# Altium schematic sheet Top.SchDoc
size D; Organization: Altium Limited; Address1: L3, 12a Rodborough Rd; Address2: Frenchs Forest; Address3: NSW; Address4: Australia 2086
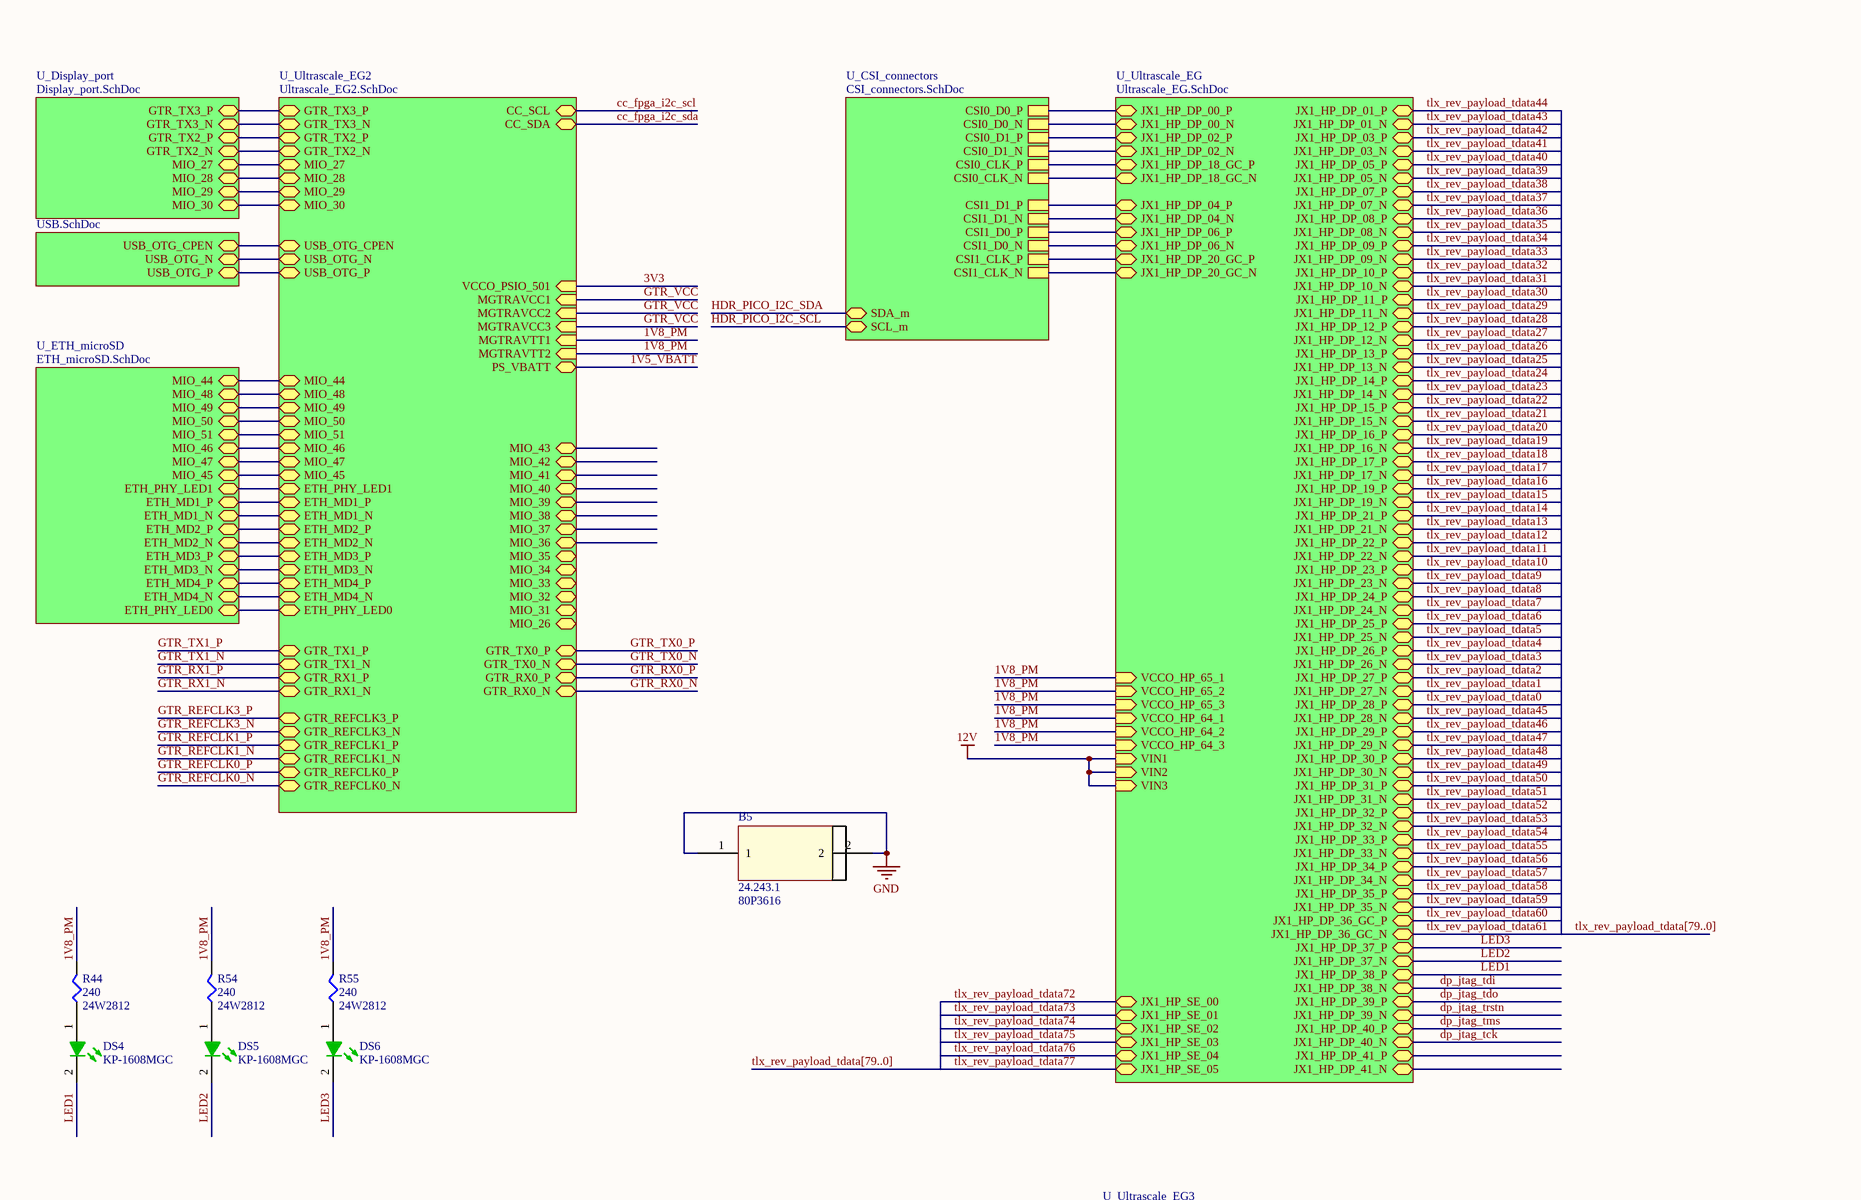
[diagram p0: Top.SchDoc, top left]
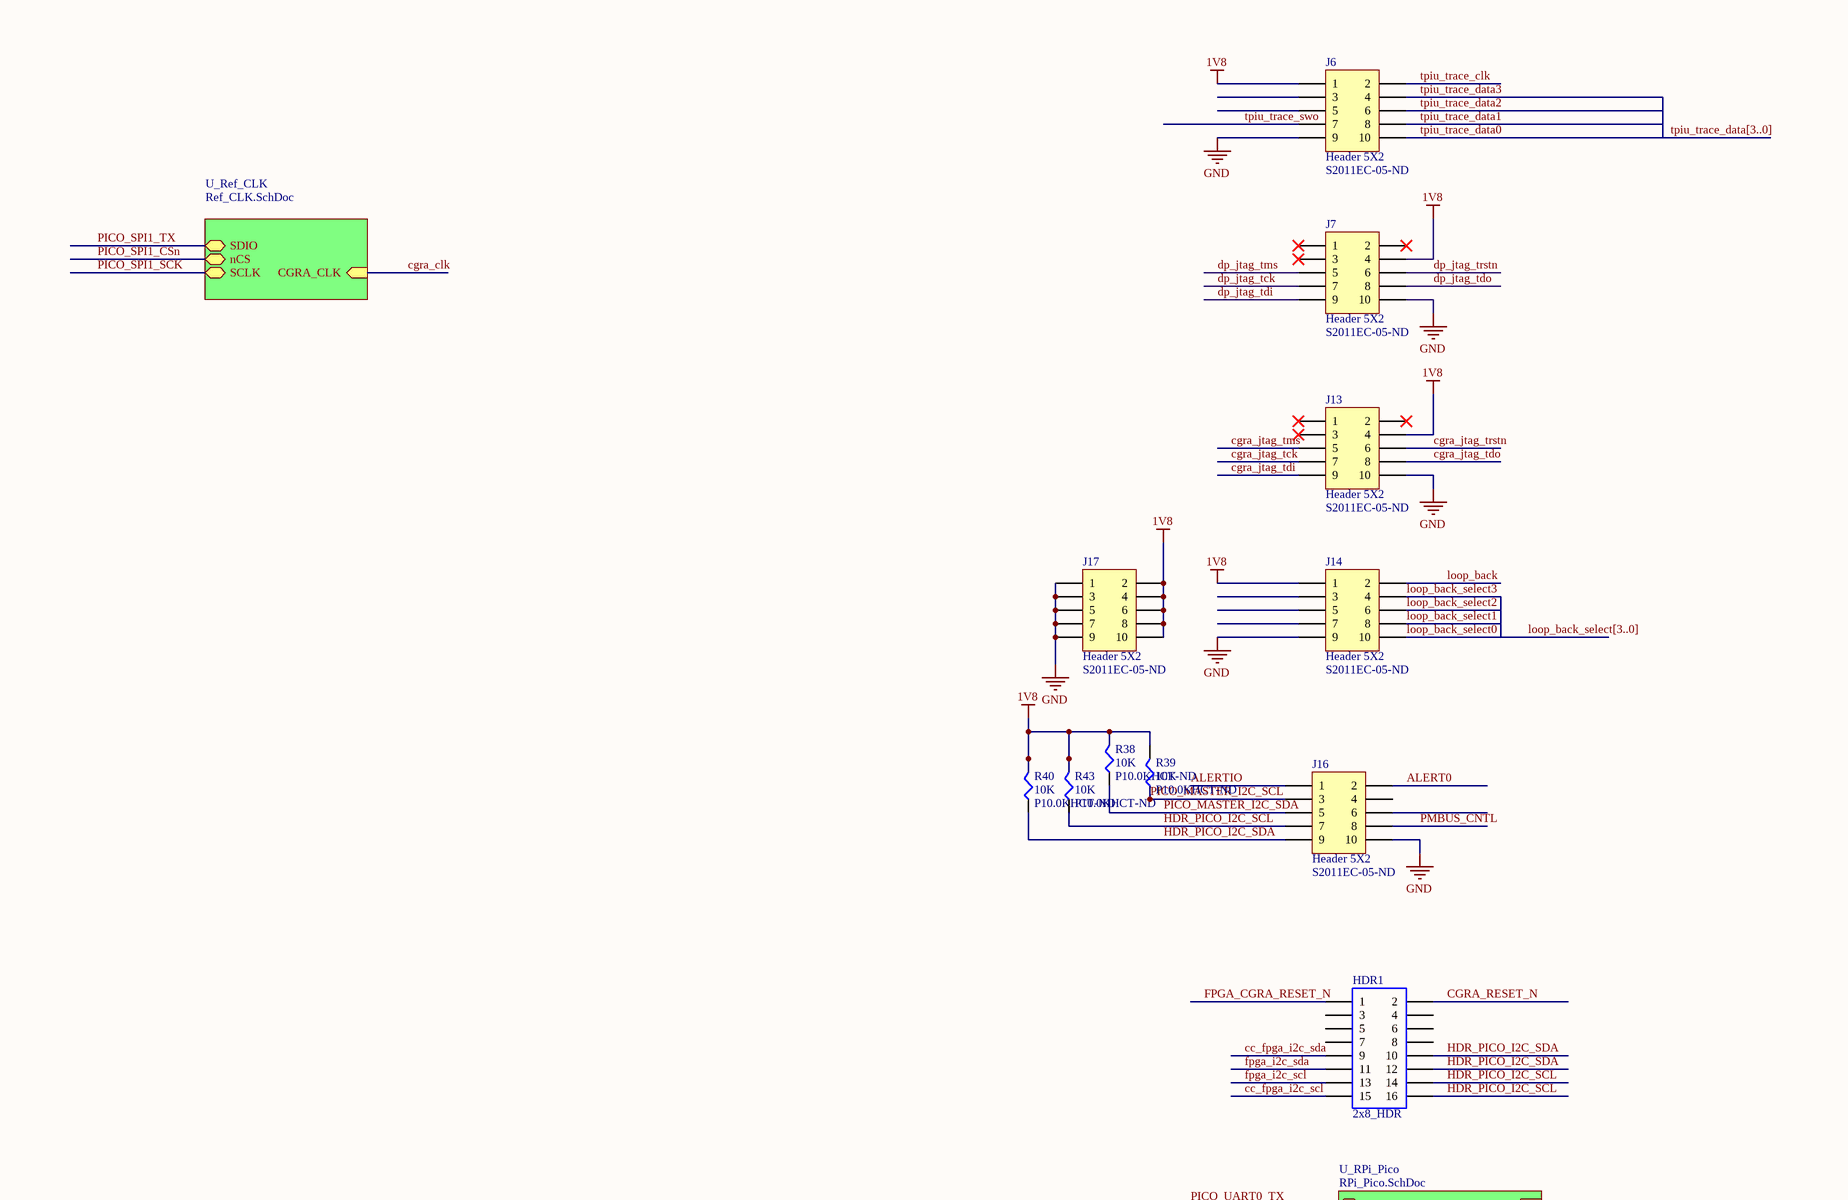
[diagram p1: Top.SchDoc, top right]
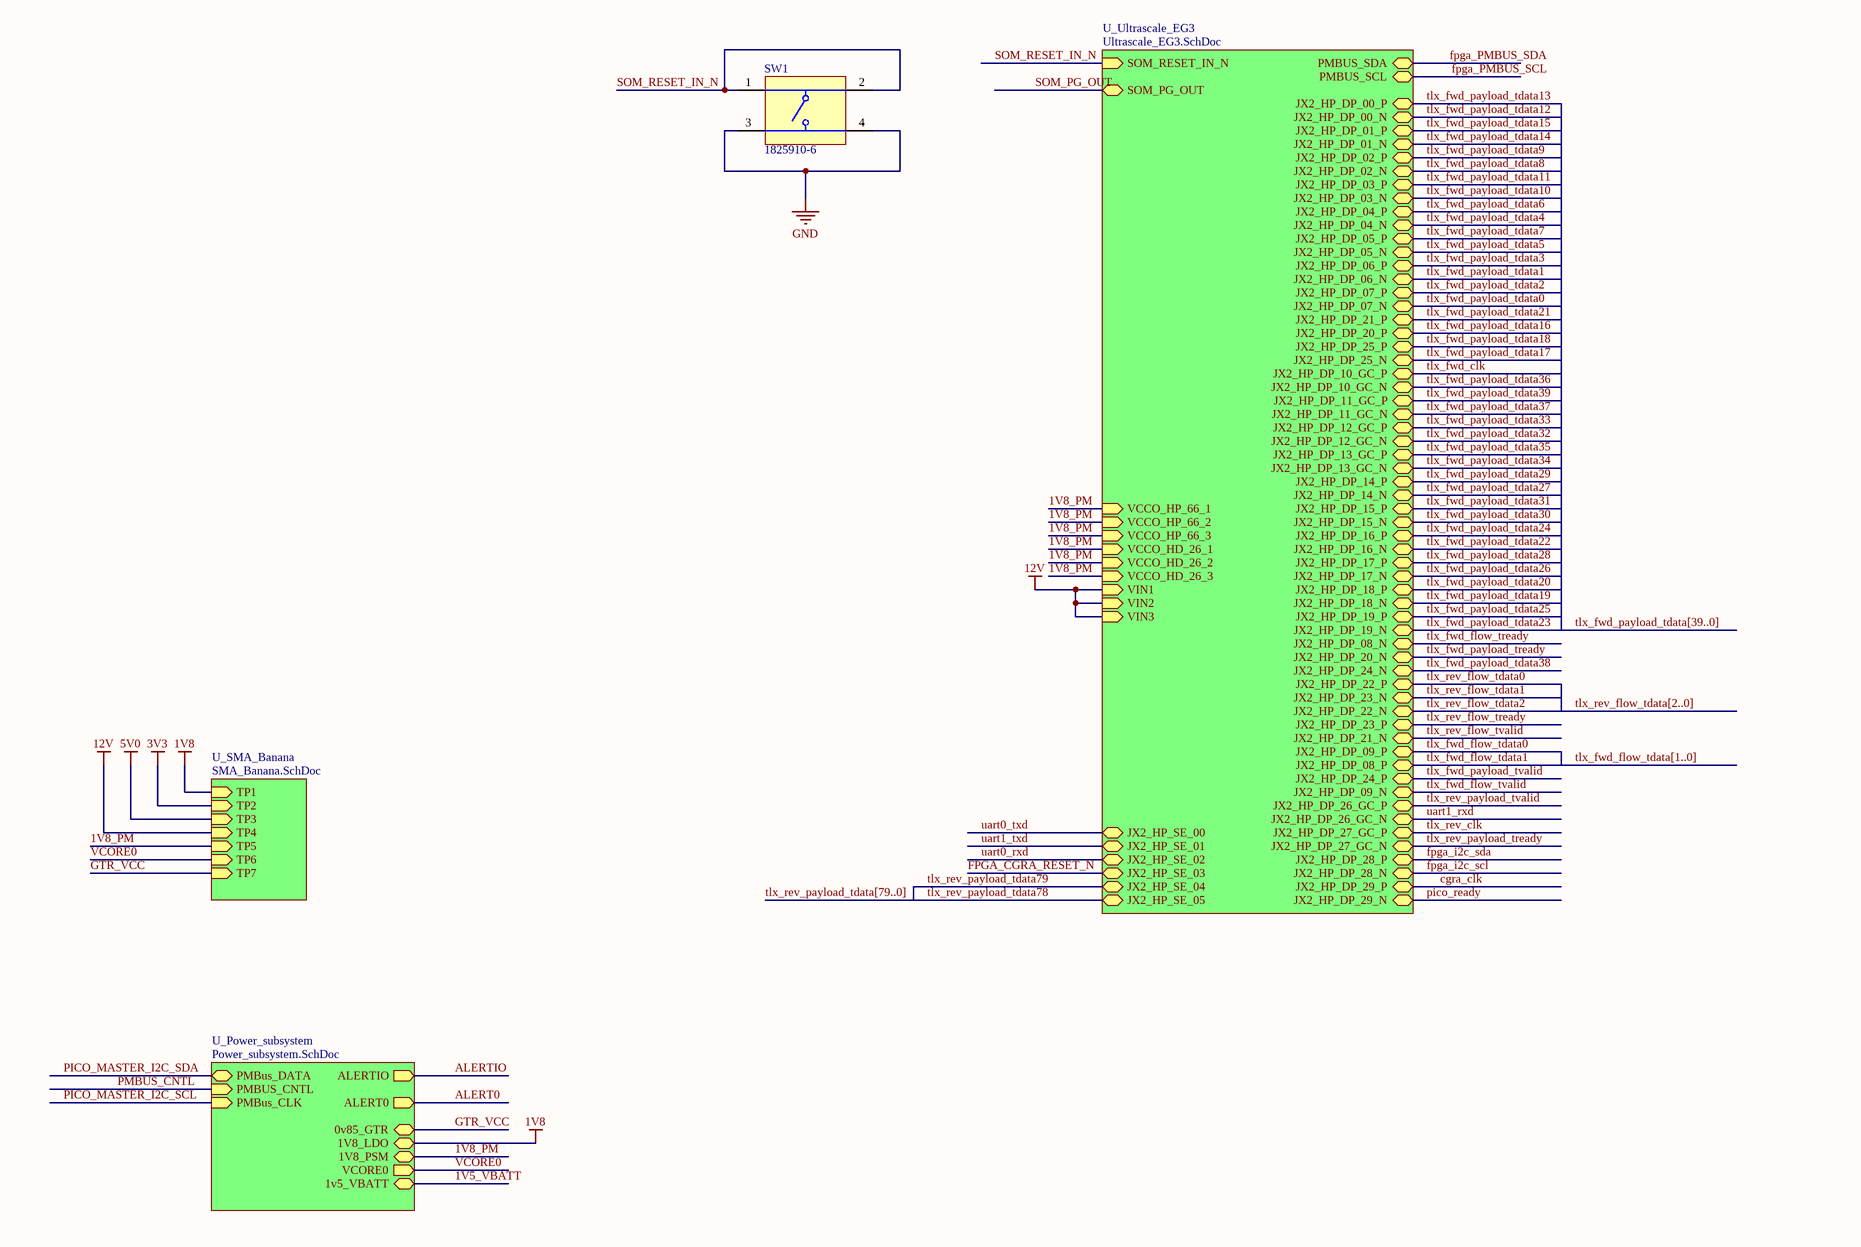
[diagram p2: Top.SchDoc, bottom left]
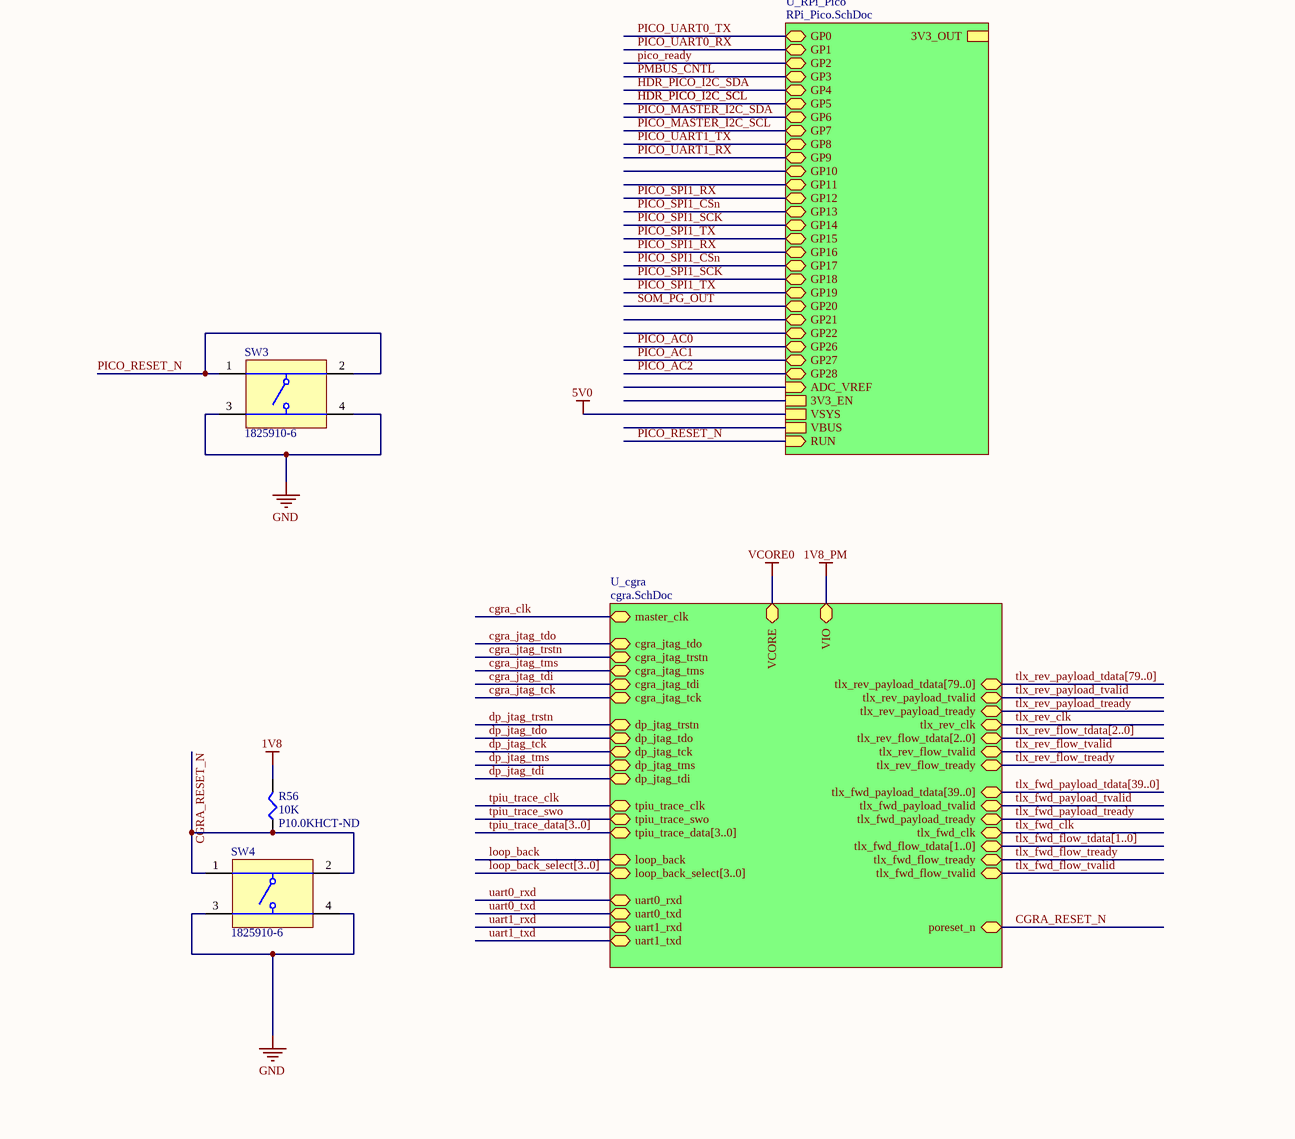
[diagram p3: Top.SchDoc, bottom right]

## Parts
B5  24.243.1  Supplier Part Number 1: 80P3616  [banana_clip]
DS4  KP-1608MGC  [KING-0603LED_GREEN_V]
DS5  KP-1608MGC  [KING-0603LED_GREEN_V]
DS6  KP-1608MGC  [KING-0603LED_GREEN_V]
HDR1  2x8_HDR  [16POSHDR]
J6  Header 5X2  Supplier Part Number 1: S2011EC-05-ND  [HDR2X5]
J7  Header 5X2  Supplier Part Number 1: S2011EC-05-ND  [HDR2X5]
J13  Header 5X2  Supplier Part Number 1: S2011EC-05-ND  [HDR2X5]
J14  Header 5X2  Supplier Part Number 1: S2011EC-05-ND  [HDR2X5]
J16  Header 5X2  Supplier Part Number 1: S2011EC-05-ND  [HDR2X5]
J17  Header 5X2  Supplier Part Number 1: S2011EC-05-ND  [HDR2X5]
R38  Resistance: 10K  Supplier Part Number 1: P10.0KHCT-ND  [RESC1608X06N]  (hidden comment: RES_10K_0603)
R39  Resistance: 10K  Supplier Part Number 1: P10.0KHCT-ND  [RESC1608X06N]  (hidden comment: RES_10K_0603)
R40  Resistance: 10K  Supplier Part Number 1: P10.0KHCT-ND  [RESC1608X06N]  (hidden comment: RES_10K_0603)
R43  Resistance: 10K  Supplier Part Number 1: P10.0KHCT-ND  [RESC1608X06N]  (hidden comment: RES_10K_0603)
R44  Resistance: 240  Supplier Part Number 1: 24W2812  [RESC1608X06N]  (hidden comment: RES_240_0603)
R54  Resistance: 240  Supplier Part Number 1: 24W2812  [RESC1608X06N]  (hidden comment: RES_240_0603)
R55  Resistance: 240  Supplier Part Number 1: 24W2812  [RESC1608X06N]  (hidden comment: RES_240_0603)
R56  Resistance: 10K  Supplier Part Number 1: P10.0KHCT-ND  [RESC1608X06N]  (hidden comment: RES_10K_0603)
SW1  1825910-6  [TECO-1825910-6_V]
SW3  1825910-6  [TECO-1825910-6_V]
SW4  1825910-6  [TECO-1825910-6_V]

## Sub-sheets
U_cgra = cgra.SchDoc: master_clk (bidir), cgra_jtag_tdo (bidir), cgra_jtag_trstn (bidir), cgra_jtag_tms (bidir), cgra_jtag_tdi (bidir), cgra_jtag_tck (bidir), dp_jtag_trstn (bidir), dp_jtag_tdo (bidir), dp_jtag_tck (bidir), dp_jtag_tms (bidir), dp_jtag_tdi (bidir), tlx_fwd_flow_tvalid (bidir), tlx_fwd_flow_tready (bidir), tlx_rev_flow_tready (bidir), tlx_rev_flow_tvalid (bidir), tlx_rev_clk (bidir), tlx_fwd_clk (bidir), tlx_rev_payload_tready (bidir), tlx_rev_payload_tvalid (bidir), tpiu_trace_clk (bidir), tpiu_trace_swo (bidir), tpiu_trace_data[3..0] (bidir), loop_back_select[3..0] (bidir), tlx_rev_flow_tdata[2..0] (bidir), tlx_fwd_flow_tdata[1..0] (bidir), tlx_fwd_payload_tdata[39..0] (bidir), tlx_rev_payload_tdata[79..0] (bidir), VCORE (bidir), VIO (bidir), loop_back (bidir), poreset_n (bidir), tlx_fwd_payload_tready (bidir), tlx_fwd_payload_tvalid (bidir), uart0_txd (bidir), uart1_txd (bidir), uart1_rxd (bidir), uart0_rxd (bidir)
U_CSI_connectors = CSI_connectors.SchDoc: CSI0_CLK_P, CSI0_CLK_N, CSI0_D0_P, CSI0_D0_N, CSI0_D1_P, CSI0_D1_N, CSI1_CLK_P, CSI1_CLK_N, CSI1_D1_P, CSI1_D1_N, CSI1_D0_P, CSI1_D0_N, SDA_m (bidir), SCL_m (bidir)
U_Display_port = Display_port.SchDoc: GTR_TX3_P (bidir), GTR_TX3_N (bidir), GTR_TX2_P (bidir), GTR_TX2_N (bidir), MIO_28 (bidir), MIO_29 (bidir), MIO_27 (bidir), MIO_30 (bidir)
U_ETH_microSD = ETH_microSD.SchDoc: MIO_44 (bidir), MIO_48 (bidir), MIO_49 (bidir), MIO_50 (bidir), MIO_51 (bidir), MIO_46 (bidir), MIO_47 (bidir), MIO_45 (bidir), ETH_PHY_LED1 (bidir), ETH_MD1_P (bidir), ETH_MD1_N (bidir), ETH_MD2_P (bidir), ETH_MD2_N (bidir), ETH_MD3_P (bidir), ETH_MD3_N (bidir), ETH_MD4_P (bidir), ETH_MD4_N (bidir), ETH_PHY_LED0 (bidir)
U_Power_subsystem = Power_subsystem.SchDoc: ALERTIO (out), ALERT0 (out), PMBus_DATA (bidir), PMBUS_CNTL (in), PMBus_CLK (in), 1V8_LDO (bidir), 1V8_PSM (bidir), VCORE0 (out), 0v85_GTR (bidir), 1v5_VBATT (bidir)
U_Ref_CLK = Ref_CLK.SchDoc: CGRA_CLK (in), SDIO (bidir), nCS (bidir), SCLK (bidir)
U_RPi_Pico = RPi_Pico.SchDoc: GP0 (bidir), GP1 (bidir), GP2 (bidir), GP3 (bidir), GP4 (bidir), GP5 (bidir), GP6 (bidir), GP7 (bidir), GP8 (bidir), GP9 (bidir), GP10 (bidir), GP11 (bidir), GP12 (bidir), GP13 (bidir), GP14 (bidir), GP15 (bidir), GP16 (bidir), GP17 (bidir), GP19 (bidir), GP20 (bidir), GP21 (bidir), GP22 (bidir), GP26 (bidir), GP27 (bidir), GP28 (bidir), ADC_VREF (in), RUN (in), GP18 (bidir), 3V3_EN, 3V3_OUT, VSYS, VBUS
U_SMA_Banana = SMA_Banana.SchDoc: TP1 (in), TP2 (in), TP3 (in), TP4 (in), TP5 (in), TP6 (in), TP7 (in)
U_Ultrascale_EG = Ultrascale_EG.SchDoc: JX1_HP_DP_00_P (bidir), JX1_HP_DP_00_N (bidir), JX1_HP_DP_02_P (bidir), JX1_HP_DP_02_N (bidir), JX1_HP_DP_04_P (bidir), JX1_HP_DP_04_N (bidir), JX1_HP_DP_06_P (bidir), JX1_HP_DP_06_N (bidir), JX1_HP_DP_08_P (bidir), JX1_HP_DP_08_N (bidir), JX1_HP_DP_10_P (bidir), JX1_HP_DP_10_N (bidir), JX1_HP_DP_12_P (bidir), JX1_HP_DP_12_N (bidir), JX1_HP_DP_14_P (bidir), JX1_HP_DP_14_N (bidir), JX1_HP_DP_16_P (bidir), JX1_HP_DP_16_N (bidir), JX1_HP_DP_18_GC_P (bidir), JX1_HP_DP_18_GC_N (bidir), JX1_HP_DP_20_GC_N (bidir), JX1_HP_DP_20_GC_P (bidir), JX1_HP_DP_22_P (bidir), JX1_HP_DP_22_N (bidir), JX1_HP_DP_24_P (bidir), JX1_HP_DP_24_N (bidir), JX1_HP_DP_26_P (bidir), JX1_HP_DP_26_N (bidir), JX1_HP_DP_28_P (bidir), JX1_HP_DP_28_N (bidir), JX1_HP_DP_30_P (bidir), JX1_HP_DP_30_N (bidir), JX1_HP_DP_32_P (bidir), JX1_HP_DP_32_N (bidir), JX1_HP_DP_34_P (bidir), JX1_HP_DP_34_N (bidir), JX1_HP_DP_36_GC_P (bidir), JX1_HP_DP_36_GC_N (bidir), JX1_HP_DP_01_P (bidir), JX1_HP_DP_01_N (bidir), JX1_HP_DP_03_P (bidir), JX1_HP_DP_03_N (bidir), JX1_HP_DP_05_P (bidir), JX1_HP_DP_05_N (bidir), JX1_HP_DP_07_P (bidir), JX1_HP_DP_07_N (bidir), JX1_HP_DP_09_P (bidir), JX1_HP_DP_09_N (bidir), JX1_HP_DP_11_P (bidir), JX1_HP_DP_11_N (bidir), JX1_HP_DP_13_P (bidir), JX1_HP_DP_13_N (bidir), JX1_HP_DP_15_P (bidir), JX1_HP_DP_15_N (bidir), JX1_HP_DP_17_P (bidir), JX1_HP_DP_17_N (bidir), JX1_HP_DP_19_P (bidir), JX1_HP_DP_19_N (bidir), JX1_HP_DP_21_P (bidir), JX1_HP_DP_21_N (bidir), JX1_HP_DP_23_P (bidir), JX1_HP_DP_23_N (bidir), JX1_HP_DP_25_P (bidir), JX1_HP_DP_25_N (bidir), JX1_HP_DP_27_P (bidir), JX1_HP_DP_27_N (bidir), JX1_HP_DP_39_P (bidir), JX1_HP_DP_39_N (bidir), JX1_HP_DP_41_P (bidir), JX1_HP_DP_41_N (bidir), VIN3 (in), JX1_HP_SE_01 (bidir), JX1_HP_SE_03 (bidir), JX1_HP_SE_05 (bidir), JX1_HP_SE_00 (bidir), VIN1 (in), VIN2 (in), JX1_HP_DP_40_N (bidir), JX1_HP_DP_40_P (bidir), JX1_HP_DP_38_N (bidir), JX1_HP_DP_38_P (bidir), JX1_HP_DP_37_N (bidir), JX1_HP_DP_35_N (bidir), JX1_HP_DP_37_P (bidir), JX1_HP_DP_35_P (bidir), JX1_HP_DP_33_N (bidir), JX1_HP_DP_31_N (bidir), JX1_HP_DP_31_P (bidir), VCCO_HP_65_3 (in), VCCO_HP_64_2 (in), VCCO_HP_65_2 (in), VCCO_HP_64_1 (in), VCCO_HP_65_1 (in), VCCO_HP_64_3 (in), JX1_HP_DP_33_P (bidir), JX1_HP_DP_29_P (bidir), JX1_HP_SE_04 (bidir), JX1_HP_SE_02 (bidir), JX1_HP_DP_29_N (bidir)
U_Ultrascale_EG2 = Ultrascale_EG2.SchDoc: GTR_TX3_P (bidir), GTR_TX3_N (bidir), GTR_TX2_P (bidir), GTR_TX2_N (bidir), GTR_TX1_P (bidir), GTR_TX1_N (bidir), GTR_TX0_P (bidir), GTR_TX0_N (bidir), GTR_REFCLK3_P (bidir), GTR_REFCLK3_N (bidir), GTR_REFCLK1_P (bidir), GTR_REFCLK1_N (bidir), CC_SDA (bidir), USB_OTG_P (bidir), USB_OTG_N (bidir), ETH_PHY_LED0 (bidir), ETH_MD1_P (bidir), ETH_MD1_N (bidir), ETH_MD3_P (bidir), ETH_MD3_N (bidir), MIO_28 (bidir), MIO_44 (bidir), MIO_46 (bidir), MIO_48 (bidir), MIO_50 (bidir), GTR_RX1_P (bidir), GTR_RX1_N (bidir), GTR_RX0_P (bidir), GTR_RX0_N (bidir), CC_SCL (bidir), USB_OTG_CPEN (bidir), ETH_PHY_LED1 (bidir), ETH_MD2_P (bidir), ETH_MD2_N (bidir), ETH_MD4_P (bidir), ETH_MD4_N (bidir), MIO_27 (bidir), MIO_29 (bidir), MIO_45 (bidir), MIO_47 (bidir), MIO_49 (bidir), MIO_51 (bidir), MIO_30 (bidir), MGTRAVCC1 (in), MGTRAVCC3 (in), VCCO_PSIO_501 (in), MGTRAVTT1 (in), MGTRAVTT2 (in), MGTRAVCC2 (in), GTR_REFCLK0_P (bidir), GTR_REFCLK0_N (bidir), MIO_37 (bidir), PS_VBATT (bidir), MIO_41 (bidir), MIO_35 (bidir), MIO_36 (bidir), MIO_43 (bidir), MIO_40 (bidir), MIO_39 (bidir), MIO_33 (bidir), MIO_31 (bidir), MIO_38 (bidir), MIO_32 (bidir), MIO_34 (bidir), MIO_42 (bidir), MIO_26 (bidir)
U_Ultrascale_EG3 = Ultrascale_EG3.SchDoc: PMBUS_SDA (bidir), JX2_HP_DP_00_P (bidir), JX2_HP_DP_00_N (bidir), JX2_HP_DP_02_P (bidir), JX2_HP_DP_02_N (bidir), JX2_HP_DP_04_P (bidir), JX2_HP_DP_04_N (bidir), JX2_HP_DP_06_P (bidir), JX2_HP_DP_06_N (bidir), JX2_HP_DP_08_P (bidir), JX2_HP_DP_08_N (bidir), JX2_HP_DP_10_GC_P (bidir), JX2_HP_DP_10_GC_N (bidir), JX2_HP_DP_12_GC_P (bidir), JX2_HP_DP_12_GC_N (bidir), JX2_HP_DP_14_P (bidir), JX2_HP_DP_14_N (bidir), JX2_HP_DP_16_P (bidir), JX2_HP_DP_16_N (bidir), JX2_HP_DP_18_P (bidir), JX2_HP_DP_18_N (bidir), JX2_HP_DP_20_P (bidir), JX2_HP_DP_20_N (bidir), JX2_HP_DP_22_P (bidir), JX2_HP_DP_22_N (bidir), JX2_HP_DP_24_P (bidir), JX2_HP_DP_24_N (bidir), JX2_HP_DP_26_GC_P (bidir), JX2_HP_DP_26_GC_N (bidir), JX2_HP_DP_28_P (bidir), JX2_HP_DP_28_N (bidir), JX2_HP_SE_04 (bidir), PMBUS_SCL (bidir), JX2_HP_DP_01_P (bidir), JX2_HP_DP_01_N (bidir), JX2_HP_DP_03_P (bidir), JX2_HP_DP_03_N (bidir), JX2_HP_DP_05_P (bidir), JX2_HP_DP_05_N (bidir), JX2_HP_DP_07_P (bidir), JX2_HP_DP_07_N (bidir), JX2_HP_DP_09_P (bidir), JX2_HP_DP_09_N (bidir), JX2_HP_DP_11_GC_P (bidir), JX2_HP_DP_11_GC_N (bidir), JX2_HP_DP_13_GC_P (bidir), JX2_HP_DP_13_GC_N (bidir), JX2_HP_DP_15_P (bidir), JX2_HP_DP_15_N (bidir), JX2_HP_DP_17_P (bidir), JX2_HP_DP_17_N (bidir), JX2_HP_DP_19_P (bidir), JX2_HP_DP_19_N (bidir), JX2_HP_DP_21_P (bidir), JX2_HP_DP_21_N (bidir), JX2_HP_DP_23_P (bidir), JX2_HP_DP_23_N (bidir), JX2_HP_DP_25_P (bidir), JX2_HP_DP_25_N (bidir), JX2_HP_DP_27_GC_P (bidir), JX2_HP_DP_27_GC_N (bidir), JX2_HP_DP_29_P (bidir), JX2_HP_DP_29_N (bidir), JX2_HP_SE_02 (bidir), JX2_HP_SE_00 (bidir), JX2_HP_SE_05 (bidir), JX2_HP_SE_03 (bidir), VIN2 (in), VIN1 (in), JX2_HP_SE_01 (bidir), VIN3 (in), VCCO_HD_26_3 (in), VCCO_HD_26_2 (in), VCCO_HD_26_1 (in), VCCO_HP_66_3 (in), VCCO_HP_66_2 (in), VCCO_HP_66_1 (in), SOM_RESET_IN_N (in), SOM_PG_OUT (bidir)
U_USB = USB.SchDoc: USB_OTG_CPEN (bidir), USB_OTG_N (bidir), USB_OTG_P (bidir)

## Nets
1V8: J6.1 J7.4 J13.4 J14.1 J17.2 J17.4 J17.6 J17.8 J17.10 R38.1 R39.1 R40.1 R43.1 R56.1 ; sheet U_Power_subsystem/1V8_LDO, sheet U_SMA_Banana/TP1
1V8_PM: R44.1 R54.1 R55.1 ; sheet U_Ultrascale_EG2/MGTRAVTT1, sheet U_Ultrascale_EG2/MGTRAVTT2, sheet U_Ultrascale_EG/VCCO_HP_65_3, sheet U_Ultrascale_EG/VCCO_HP_64_2, sheet U_Ultrascale_EG/VCCO_HP_65_2, sheet U_Ultrascale_EG/VCCO_HP_64_1, sheet U_Ultrascale_EG/VCCO_HP_65_1, sheet U_Ultrascale_EG/VCCO_HP_64_3, sheet U_Ultrascale_EG3/VCCO_HD_26_3, sheet U_Ultrascale_EG3/VCCO_HD_26_2, sheet U_Ultrascale_EG3/VCCO_HD_26_1, sheet U_Ultrascale_EG3/VCCO_HP_66_3, sheet U_Ultrascale_EG3/VCCO_HP_66_2, sheet U_Ultrascale_EG3/VCCO_HP_66_1, sheet U_Power_subsystem/1V8_PSM, sheet U_SMA_Banana/TP5, sheet U_cgra/VIO
3V3: sheet U_Ultrascale_EG2/VCCO_PSIO_501, sheet U_SMA_Banana/TP2
5V0: sheet U_SMA_Banana/TP3, sheet U_RPi_Pico/VSYS
12V: sheet U_Ultrascale_EG/VIN3, sheet U_Ultrascale_EG/VIN1, sheet U_Ultrascale_EG/VIN2, sheet U_Ultrascale_EG3/VIN2, sheet U_Ultrascale_EG3/VIN1, sheet U_Ultrascale_EG3/VIN3, sheet U_SMA_Banana/TP4
GND: B5.1 B5.2 J6.9 J7.10 J13.10 J14.9 J16.10 J17.1 J17.3 J17.5 J17.7 J17.9 SW1.3 SW1.4 SW3.3 SW3.4 SW4.3 SW4.4
VCORE0: sheet U_Power_subsystem/VCORE0, sheet U_SMA_Banana/TP6, sheet U_cgra/VCORE
1V5_VBATT: sheet U_Ultrascale_EG2/PS_VBATT, sheet U_Power_subsystem/1v5_VBATT
ALERT0: J16.2 ; sheet U_Power_subsystem/ALERT0
ALERTIO: J16.1 ; sheet U_Power_subsystem/ALERTIO
cc_fpga_i2c_scl: HDR1.15 ; sheet U_Ultrascale_EG2/CC_SCL
cc_fpga_i2c_sda: HDR1.9 ; sheet U_Ultrascale_EG2/CC_SDA
cgra_clk: sheet U_Ultrascale_EG3/JX2_HP_DP_29_P, sheet U_Ref_CLK/CGRA_CLK, sheet U_cgra/master_clk
cgra_jtag_tck: J13.7 ; sheet U_cgra/cgra_jtag_tck
cgra_jtag_tdi: J13.9 ; sheet U_cgra/cgra_jtag_tdi
cgra_jtag_tdo: J13.8 ; sheet U_cgra/cgra_jtag_tdo
cgra_jtag_tms: J13.5 ; sheet U_cgra/cgra_jtag_tms
cgra_jtag_trstn: J13.6 ; sheet U_cgra/cgra_jtag_trstn
CGRA_RESET_N: HDR1.2 R56.2 SW4.1 SW4.2 ; sheet U_cgra/poreset_n
dp_jtag_tck: J7.7 ; sheet U_Ultrascale_EG/JX1_HP_DP_40_N, sheet U_cgra/dp_jtag_tck
dp_jtag_tdi: J7.9 ; sheet U_Ultrascale_EG/JX1_HP_DP_38_N, sheet U_cgra/dp_jtag_tdi
dp_jtag_tdo: J7.8 ; sheet U_Ultrascale_EG/JX1_HP_DP_39_P, sheet U_cgra/dp_jtag_tdo
dp_jtag_tms: J7.5 ; sheet U_Ultrascale_EG/JX1_HP_DP_40_P, sheet U_cgra/dp_jtag_tms
dp_jtag_trstn: J7.6 ; sheet U_Ultrascale_EG/JX1_HP_DP_39_N, sheet U_cgra/dp_jtag_trstn
FPGA_CGRA_RESET_N: HDR1.1 ; sheet U_Ultrascale_EG3/JX2_HP_SE_03
fpga_i2c_scl: HDR1.13 ; sheet U_Ultrascale_EG3/JX2_HP_DP_28_N
fpga_i2c_sda: HDR1.11 ; sheet U_Ultrascale_EG3/JX2_HP_DP_28_P
fpga_PMBUS_SCL: sheet U_Ultrascale_EG3/PMBUS_SCL
fpga_PMBUS_SDA: sheet U_Ultrascale_EG3/PMBUS_SDA
GTR_REFCLK0_N: sheet U_Ultrascale_EG2/GTR_REFCLK0_N
GTR_REFCLK0_P: sheet U_Ultrascale_EG2/GTR_REFCLK0_P
GTR_REFCLK1_N: sheet U_Ultrascale_EG2/GTR_REFCLK1_N
GTR_REFCLK1_P: sheet U_Ultrascale_EG2/GTR_REFCLK1_P
GTR_REFCLK3_N: sheet U_Ultrascale_EG2/GTR_REFCLK3_N
GTR_REFCLK3_P: sheet U_Ultrascale_EG2/GTR_REFCLK3_P
GTR_RX0_N: sheet U_Ultrascale_EG2/GTR_RX0_N
GTR_RX0_P: sheet U_Ultrascale_EG2/GTR_RX0_P
GTR_RX1_N: sheet U_Ultrascale_EG2/GTR_RX1_N
GTR_RX1_P: sheet U_Ultrascale_EG2/GTR_RX1_P
GTR_TX0_N: sheet U_Ultrascale_EG2/GTR_TX0_N
GTR_TX0_P: sheet U_Ultrascale_EG2/GTR_TX0_P
GTR_TX1_N: sheet U_Ultrascale_EG2/GTR_TX1_N
GTR_TX1_P: sheet U_Ultrascale_EG2/GTR_TX1_P
GTR_VCC: sheet U_Ultrascale_EG2/MGTRAVCC1, sheet U_Ultrascale_EG2/MGTRAVCC3, sheet U_Ultrascale_EG2/MGTRAVCC2, sheet U_Power_subsystem/0v85_GTR, sheet U_SMA_Banana/TP7
HDR_PICO_I2C_SCL: HDR1.14 HDR1.16 J16.7 R43.2 ; sheet U_CSI_connectors/SCL_m, sheet U_RPi_Pico/GP5
HDR_PICO_I2C_SDA: HDR1.10 HDR1.12 J16.9 R40.2 ; sheet U_CSI_connectors/SDA_m, sheet U_RPi_Pico/GP4
LED1: DS4.2(K) ; sheet U_Ultrascale_EG/JX1_HP_DP_38_P
LED2: DS5.2(K) ; sheet U_Ultrascale_EG/JX1_HP_DP_37_N
LED3: DS6.2(K) ; sheet U_Ultrascale_EG/JX1_HP_DP_37_P
loop_back: J14.2 ; sheet U_cgra/loop_back
loop_back_select0: J14.10
loop_back_select1: J14.8
loop_back_select2: J14.6
loop_back_select3: J14.4
PICO_AC0: sheet U_RPi_Pico/GP26
PICO_AC1: sheet U_RPi_Pico/GP27
PICO_AC2: sheet U_RPi_Pico/GP28
PICO_MASTER_I2C_SCL: J16.3 R39.2 ; sheet U_Power_subsystem/PMBus_CLK, sheet U_RPi_Pico/GP7
PICO_MASTER_I2C_SDA: J16.5 R38.2 ; sheet U_Power_subsystem/PMBus_DATA, sheet U_RPi_Pico/GP6
pico_ready: sheet U_Ultrascale_EG3/JX2_HP_DP_29_N, sheet U_RPi_Pico/GP2
PICO_RESET_N: SW3.1 SW3.2 ; sheet U_RPi_Pico/RUN
PICO_SPI1_CSn: sheet U_Ref_CLK/nCS, sheet U_RPi_Pico/GP13, sheet U_RPi_Pico/GP17
PICO_SPI1_RX: sheet U_RPi_Pico/GP12, sheet U_RPi_Pico/GP16
PICO_SPI1_SCK: sheet U_Ref_CLK/SCLK, sheet U_RPi_Pico/GP14, sheet U_RPi_Pico/GP18
PICO_SPI1_TX: sheet U_Ref_CLK/SDIO, sheet U_RPi_Pico/GP15, sheet U_RPi_Pico/GP19
PICO_UART0_RX: sheet U_RPi_Pico/GP1
PICO_UART0_TX: sheet U_RPi_Pico/GP0
PICO_UART1_RX: sheet U_RPi_Pico/GP9
PICO_UART1_TX: sheet U_RPi_Pico/GP8
PMBUS_CNTL: J16.8 ; sheet U_Power_subsystem/PMBUS_CNTL, sheet U_RPi_Pico/GP3
SOM_PG_OUT: sheet U_Ultrascale_EG3/SOM_PG_OUT, sheet U_RPi_Pico/GP20
SOM_RESET_IN_N: SW1.1 SW1.2 ; sheet U_Ultrascale_EG3/SOM_RESET_IN_N
tlx_fwd_clk: sheet U_Ultrascale_EG3/JX2_HP_DP_10_GC_P, sheet U_cgra/tlx_fwd_clk
tlx_fwd_flow_tdata0: sheet U_Ultrascale_EG3/JX2_HP_DP_09_P
tlx_fwd_flow_tdata1: sheet U_Ultrascale_EG3/JX2_HP_DP_08_P
tlx_fwd_flow_tready: sheet U_Ultrascale_EG3/JX2_HP_DP_08_N, sheet U_cgra/tlx_fwd_flow_tready
tlx_fwd_flow_tvalid: sheet U_Ultrascale_EG3/JX2_HP_DP_09_N, sheet U_cgra/tlx_fwd_flow_tvalid
tlx_fwd_payload_tdata0: sheet U_Ultrascale_EG3/JX2_HP_DP_07_N
tlx_fwd_payload_tdata1: sheet U_Ultrascale_EG3/JX2_HP_DP_06_N
tlx_fwd_payload_tdata2: sheet U_Ultrascale_EG3/JX2_HP_DP_07_P
tlx_fwd_payload_tdata3: sheet U_Ultrascale_EG3/JX2_HP_DP_06_P
tlx_fwd_payload_tdata4: sheet U_Ultrascale_EG3/JX2_HP_DP_04_N
tlx_fwd_payload_tdata5: sheet U_Ultrascale_EG3/JX2_HP_DP_05_N
tlx_fwd_payload_tdata6: sheet U_Ultrascale_EG3/JX2_HP_DP_04_P
tlx_fwd_payload_tdata7: sheet U_Ultrascale_EG3/JX2_HP_DP_05_P
tlx_fwd_payload_tdata8: sheet U_Ultrascale_EG3/JX2_HP_DP_02_N
tlx_fwd_payload_tdata9: sheet U_Ultrascale_EG3/JX2_HP_DP_02_P
tlx_fwd_payload_tdata10: sheet U_Ultrascale_EG3/JX2_HP_DP_03_N
tlx_fwd_payload_tdata11: sheet U_Ultrascale_EG3/JX2_HP_DP_03_P
tlx_fwd_payload_tdata12: sheet U_Ultrascale_EG3/JX2_HP_DP_00_N
tlx_fwd_payload_tdata13: sheet U_Ultrascale_EG3/JX2_HP_DP_00_P
tlx_fwd_payload_tdata14: sheet U_Ultrascale_EG3/JX2_HP_DP_01_N
tlx_fwd_payload_tdata15: sheet U_Ultrascale_EG3/JX2_HP_DP_01_P
tlx_fwd_payload_tdata16: sheet U_Ultrascale_EG3/JX2_HP_DP_20_P
tlx_fwd_payload_tdata17: sheet U_Ultrascale_EG3/JX2_HP_DP_25_N
tlx_fwd_payload_tdata18: sheet U_Ultrascale_EG3/JX2_HP_DP_25_P
tlx_fwd_payload_tdata19: sheet U_Ultrascale_EG3/JX2_HP_DP_18_N
tlx_fwd_payload_tdata20: sheet U_Ultrascale_EG3/JX2_HP_DP_18_P
tlx_fwd_payload_tdata21: sheet U_Ultrascale_EG3/JX2_HP_DP_21_P
tlx_fwd_payload_tdata22: sheet U_Ultrascale_EG3/JX2_HP_DP_16_N
tlx_fwd_payload_tdata23: sheet U_Ultrascale_EG3/JX2_HP_DP_19_N
tlx_fwd_payload_tdata24: sheet U_Ultrascale_EG3/JX2_HP_DP_16_P
tlx_fwd_payload_tdata25: sheet U_Ultrascale_EG3/JX2_HP_DP_19_P
tlx_fwd_payload_tdata26: sheet U_Ultrascale_EG3/JX2_HP_DP_17_N
tlx_fwd_payload_tdata27: sheet U_Ultrascale_EG3/JX2_HP_DP_14_N
tlx_fwd_payload_tdata28: sheet U_Ultrascale_EG3/JX2_HP_DP_17_P
tlx_fwd_payload_tdata29: sheet U_Ultrascale_EG3/JX2_HP_DP_14_P
tlx_fwd_payload_tdata30: sheet U_Ultrascale_EG3/JX2_HP_DP_15_N
tlx_fwd_payload_tdata31: sheet U_Ultrascale_EG3/JX2_HP_DP_15_P
tlx_fwd_payload_tdata32: sheet U_Ultrascale_EG3/JX2_HP_DP_12_GC_N
tlx_fwd_payload_tdata33: sheet U_Ultrascale_EG3/JX2_HP_DP_12_GC_P
tlx_fwd_payload_tdata34: sheet U_Ultrascale_EG3/JX2_HP_DP_13_GC_N
tlx_fwd_payload_tdata35: sheet U_Ultrascale_EG3/JX2_HP_DP_13_GC_P
tlx_fwd_payload_tdata36: sheet U_Ultrascale_EG3/JX2_HP_DP_10_GC_N
tlx_fwd_payload_tdata37: sheet U_Ultrascale_EG3/JX2_HP_DP_11_GC_N
tlx_fwd_payload_tdata38: sheet U_Ultrascale_EG3/JX2_HP_DP_24_N
tlx_fwd_payload_tdata39: sheet U_Ultrascale_EG3/JX2_HP_DP_11_GC_P
tlx_fwd_payload_tready: sheet U_Ultrascale_EG3/JX2_HP_DP_20_N, sheet U_cgra/tlx_fwd_payload_tready
tlx_fwd_payload_tvalid: sheet U_Ultrascale_EG3/JX2_HP_DP_24_P, sheet U_cgra/tlx_fwd_payload_tvalid
tlx_rev_clk: sheet U_Ultrascale_EG3/JX2_HP_DP_27_GC_P, sheet U_cgra/tlx_rev_clk
tlx_rev_flow_tdata0: sheet U_Ultrascale_EG3/JX2_HP_DP_22_P
tlx_rev_flow_tdata1: sheet U_Ultrascale_EG3/JX2_HP_DP_23_N
tlx_rev_flow_tdata2: sheet U_Ultrascale_EG3/JX2_HP_DP_22_N
tlx_rev_flow_tready: sheet U_Ultrascale_EG3/JX2_HP_DP_23_P, sheet U_cgra/tlx_rev_flow_tready
tlx_rev_flow_tvalid: sheet U_Ultrascale_EG3/JX2_HP_DP_21_N, sheet U_cgra/tlx_rev_flow_tvalid
tlx_rev_payload_tdata0: sheet U_Ultrascale_EG/JX1_HP_DP_28_P
tlx_rev_payload_tdata1: sheet U_Ultrascale_EG/JX1_HP_DP_27_N
tlx_rev_payload_tdata2: sheet U_Ultrascale_EG/JX1_HP_DP_27_P
tlx_rev_payload_tdata3: sheet U_Ultrascale_EG/JX1_HP_DP_26_N
tlx_rev_payload_tdata4: sheet U_Ultrascale_EG/JX1_HP_DP_26_P
tlx_rev_payload_tdata5: sheet U_Ultrascale_EG/JX1_HP_DP_25_N
tlx_rev_payload_tdata6: sheet U_Ultrascale_EG/JX1_HP_DP_25_P
tlx_rev_payload_tdata7: sheet U_Ultrascale_EG/JX1_HP_DP_24_N
tlx_rev_payload_tdata8: sheet U_Ultrascale_EG/JX1_HP_DP_24_P
tlx_rev_payload_tdata9: sheet U_Ultrascale_EG/JX1_HP_DP_23_N
tlx_rev_payload_tdata10: sheet U_Ultrascale_EG/JX1_HP_DP_23_P
tlx_rev_payload_tdata11: sheet U_Ultrascale_EG/JX1_HP_DP_22_N
tlx_rev_payload_tdata12: sheet U_Ultrascale_EG/JX1_HP_DP_22_P
tlx_rev_payload_tdata13: sheet U_Ultrascale_EG/JX1_HP_DP_21_N
tlx_rev_payload_tdata14: sheet U_Ultrascale_EG/JX1_HP_DP_21_P
tlx_rev_payload_tdata15: sheet U_Ultrascale_EG/JX1_HP_DP_19_N
tlx_rev_payload_tdata16: sheet U_Ultrascale_EG/JX1_HP_DP_19_P
tlx_rev_payload_tdata17: sheet U_Ultrascale_EG/JX1_HP_DP_17_N
tlx_rev_payload_tdata18: sheet U_Ultrascale_EG/JX1_HP_DP_17_P
tlx_rev_payload_tdata19: sheet U_Ultrascale_EG/JX1_HP_DP_16_N
tlx_rev_payload_tdata20: sheet U_Ultrascale_EG/JX1_HP_DP_16_P
tlx_rev_payload_tdata21: sheet U_Ultrascale_EG/JX1_HP_DP_15_N
tlx_rev_payload_tdata22: sheet U_Ultrascale_EG/JX1_HP_DP_15_P
tlx_rev_payload_tdata23: sheet U_Ultrascale_EG/JX1_HP_DP_14_N
tlx_rev_payload_tdata24: sheet U_Ultrascale_EG/JX1_HP_DP_14_P
tlx_rev_payload_tdata25: sheet U_Ultrascale_EG/JX1_HP_DP_13_N
tlx_rev_payload_tdata26: sheet U_Ultrascale_EG/JX1_HP_DP_13_P
tlx_rev_payload_tdata27: sheet U_Ultrascale_EG/JX1_HP_DP_12_N
tlx_rev_payload_tdata28: sheet U_Ultrascale_EG/JX1_HP_DP_12_P
tlx_rev_payload_tdata29: sheet U_Ultrascale_EG/JX1_HP_DP_11_N
tlx_rev_payload_tdata30: sheet U_Ultrascale_EG/JX1_HP_DP_11_P
tlx_rev_payload_tdata31: sheet U_Ultrascale_EG/JX1_HP_DP_10_N
tlx_rev_payload_tdata32: sheet U_Ultrascale_EG/JX1_HP_DP_10_P
tlx_rev_payload_tdata33: sheet U_Ultrascale_EG/JX1_HP_DP_09_N
tlx_rev_payload_tdata34: sheet U_Ultrascale_EG/JX1_HP_DP_09_P
tlx_rev_payload_tdata35: sheet U_Ultrascale_EG/JX1_HP_DP_08_N
tlx_rev_payload_tdata36: sheet U_Ultrascale_EG/JX1_HP_DP_08_P
tlx_rev_payload_tdata37: sheet U_Ultrascale_EG/JX1_HP_DP_07_N
tlx_rev_payload_tdata38: sheet U_Ultrascale_EG/JX1_HP_DP_07_P
tlx_rev_payload_tdata39: sheet U_Ultrascale_EG/JX1_HP_DP_05_N
tlx_rev_payload_tdata40: sheet U_Ultrascale_EG/JX1_HP_DP_05_P
tlx_rev_payload_tdata41: sheet U_Ultrascale_EG/JX1_HP_DP_03_N
tlx_rev_payload_tdata42: sheet U_Ultrascale_EG/JX1_HP_DP_03_P
tlx_rev_payload_tdata43: sheet U_Ultrascale_EG/JX1_HP_DP_01_N
tlx_rev_payload_tdata44: sheet U_Ultrascale_EG/JX1_HP_DP_01_P
tlx_rev_payload_tdata45: sheet U_Ultrascale_EG/JX1_HP_DP_28_N
tlx_rev_payload_tdata46: sheet U_Ultrascale_EG/JX1_HP_DP_29_P
tlx_rev_payload_tdata47: sheet U_Ultrascale_EG/JX1_HP_DP_29_N
tlx_rev_payload_tdata48: sheet U_Ultrascale_EG/JX1_HP_DP_30_P
tlx_rev_payload_tdata49: sheet U_Ultrascale_EG/JX1_HP_DP_30_N
tlx_rev_payload_tdata50: sheet U_Ultrascale_EG/JX1_HP_DP_31_P
tlx_rev_payload_tdata51: sheet U_Ultrascale_EG/JX1_HP_DP_31_N
tlx_rev_payload_tdata52: sheet U_Ultrascale_EG/JX1_HP_DP_32_P
tlx_rev_payload_tdata53: sheet U_Ultrascale_EG/JX1_HP_DP_32_N
tlx_rev_payload_tdata54: sheet U_Ultrascale_EG/JX1_HP_DP_33_P
tlx_rev_payload_tdata55: sheet U_Ultrascale_EG/JX1_HP_DP_33_N
tlx_rev_payload_tdata56: sheet U_Ultrascale_EG/JX1_HP_DP_34_P
tlx_rev_payload_tdata57: sheet U_Ultrascale_EG/JX1_HP_DP_34_N
tlx_rev_payload_tdata58: sheet U_Ultrascale_EG/JX1_HP_DP_35_P
tlx_rev_payload_tdata59: sheet U_Ultrascale_EG/JX1_HP_DP_35_N
tlx_rev_payload_tdata60: sheet U_Ultrascale_EG/JX1_HP_DP_36_GC_P
tlx_rev_payload_tdata61: sheet U_Ultrascale_EG/JX1_HP_DP_36_GC_N
tlx_rev_payload_tdata72: sheet U_Ultrascale_EG/JX1_HP_SE_00
tlx_rev_payload_tdata73: sheet U_Ultrascale_EG/JX1_HP_SE_01
tlx_rev_payload_tdata74: sheet U_Ultrascale_EG/JX1_HP_SE_02
tlx_rev_payload_tdata75: sheet U_Ultrascale_EG/JX1_HP_SE_03
tlx_rev_payload_tdata76: sheet U_Ultrascale_EG/JX1_HP_SE_04
tlx_rev_payload_tdata77: sheet U_Ultrascale_EG/JX1_HP_SE_05
tlx_rev_payload_tdata78: sheet U_Ultrascale_EG3/JX2_HP_SE_05
tlx_rev_payload_tdata79: sheet U_Ultrascale_EG3/JX2_HP_SE_04
tlx_rev_payload_tready: sheet U_Ultrascale_EG3/JX2_HP_DP_27_GC_N, sheet U_cgra/tlx_rev_payload_tready
tlx_rev_payload_tvalid: sheet U_Ultrascale_EG3/JX2_HP_DP_26_GC_P, sheet U_cgra/tlx_rev_payload_tvalid
tpiu_trace_clk: J6.2 ; sheet U_cgra/tpiu_trace_clk
tpiu_trace_data0: J6.10
tpiu_trace_data1: J6.8
tpiu_trace_data2: J6.6
tpiu_trace_data3: J6.4
tpiu_trace_swo: J6.7 ; sheet U_cgra/tpiu_trace_swo
uart0_rxd: sheet U_Ultrascale_EG3/JX2_HP_SE_02, sheet U_cgra/uart0_rxd
uart0_txd: sheet U_Ultrascale_EG3/JX2_HP_SE_00, sheet U_cgra/uart0_txd
uart1_rxd: sheet U_Ultrascale_EG3/JX2_HP_DP_26_GC_N, sheet U_cgra/uart1_rxd
uart1_txd: sheet U_Ultrascale_EG3/JX2_HP_SE_01, sheet U_cgra/uart1_txd
NetDS4_1: DS4.1(A) R44.2
NetDS5_1: DS5.1(A) R54.2
NetDS6_1: DS6.1(A) R55.2
(unnamed): sheet U_Ultrascale_EG2/GTR_TX3_P, sheet U_Display_port/GTR_TX3_P
(unnamed): sheet U_Ultrascale_EG2/GTR_TX3_N, sheet U_Display_port/GTR_TX3_N
(unnamed): sheet U_Ultrascale_EG2/GTR_TX2_P, sheet U_Display_port/GTR_TX2_P
(unnamed): sheet U_Ultrascale_EG2/GTR_TX2_N, sheet U_Display_port/GTR_TX2_N
(unnamed): sheet U_Ultrascale_EG2/USB_OTG_P, sheet U_USB/USB_OTG_P
(unnamed): sheet U_Ultrascale_EG2/USB_OTG_N, sheet U_USB/USB_OTG_N
(unnamed): sheet U_Ultrascale_EG2/ETH_PHY_LED0, sheet U_ETH_microSD/ETH_PHY_LED0
(unnamed): sheet U_Ultrascale_EG2/ETH_MD1_P, sheet U_ETH_microSD/ETH_MD1_P
(unnamed): sheet U_Ultrascale_EG2/ETH_MD1_N, sheet U_ETH_microSD/ETH_MD1_N
(unnamed): sheet U_Ultrascale_EG2/ETH_MD3_P, sheet U_ETH_microSD/ETH_MD3_P
(unnamed): sheet U_Ultrascale_EG2/ETH_MD3_N, sheet U_ETH_microSD/ETH_MD3_N
(unnamed): sheet U_Ultrascale_EG2/MIO_28, sheet U_Display_port/MIO_28
(unnamed): sheet U_Ultrascale_EG2/MIO_44, sheet U_ETH_microSD/MIO_44
(unnamed): sheet U_Ultrascale_EG2/MIO_46, sheet U_ETH_microSD/MIO_46
(unnamed): sheet U_Ultrascale_EG2/MIO_48, sheet U_ETH_microSD/MIO_48
(unnamed): sheet U_Ultrascale_EG2/MIO_50, sheet U_ETH_microSD/MIO_50
(unnamed): sheet U_Ultrascale_EG2/USB_OTG_CPEN, sheet U_USB/USB_OTG_CPEN
(unnamed): sheet U_Ultrascale_EG2/ETH_PHY_LED1, sheet U_ETH_microSD/ETH_PHY_LED1
(unnamed): sheet U_Ultrascale_EG2/ETH_MD2_P, sheet U_ETH_microSD/ETH_MD2_P
(unnamed): sheet U_Ultrascale_EG2/ETH_MD2_N, sheet U_ETH_microSD/ETH_MD2_N
(unnamed): sheet U_Ultrascale_EG2/ETH_MD4_P, sheet U_ETH_microSD/ETH_MD4_P
(unnamed): sheet U_Ultrascale_EG2/ETH_MD4_N, sheet U_ETH_microSD/ETH_MD4_N
(unnamed): sheet U_Ultrascale_EG2/MIO_27, sheet U_Display_port/MIO_27
(unnamed): sheet U_Ultrascale_EG2/MIO_29, sheet U_Display_port/MIO_29
(unnamed): sheet U_Ultrascale_EG2/MIO_45, sheet U_ETH_microSD/MIO_45
(unnamed): sheet U_Ultrascale_EG2/MIO_47, sheet U_ETH_microSD/MIO_47
(unnamed): sheet U_Ultrascale_EG2/MIO_49, sheet U_ETH_microSD/MIO_49
(unnamed): sheet U_Ultrascale_EG2/MIO_51, sheet U_ETH_microSD/MIO_51
(unnamed): sheet U_Ultrascale_EG2/MIO_30, sheet U_Display_port/MIO_30
(unnamed): sheet U_Ultrascale_EG/JX1_HP_DP_00_P, sheet U_CSI_connectors/CSI0_D0_P
(unnamed): sheet U_Ultrascale_EG/JX1_HP_DP_00_N, sheet U_CSI_connectors/CSI0_D0_N
(unnamed): sheet U_Ultrascale_EG/JX1_HP_DP_02_P, sheet U_CSI_connectors/CSI0_D1_P
(unnamed): sheet U_Ultrascale_EG/JX1_HP_DP_02_N, sheet U_CSI_connectors/CSI0_D1_N
(unnamed): sheet U_Ultrascale_EG/JX1_HP_DP_04_P, sheet U_CSI_connectors/CSI1_D1_P
(unnamed): sheet U_Ultrascale_EG/JX1_HP_DP_04_N, sheet U_CSI_connectors/CSI1_D1_N
(unnamed): sheet U_Ultrascale_EG/JX1_HP_DP_06_P, sheet U_CSI_connectors/CSI1_D0_P
(unnamed): sheet U_Ultrascale_EG/JX1_HP_DP_06_N, sheet U_CSI_connectors/CSI1_D0_N
(unnamed): sheet U_Ultrascale_EG/JX1_HP_DP_18_GC_P, sheet U_CSI_connectors/CSI0_CLK_P
(unnamed): sheet U_Ultrascale_EG/JX1_HP_DP_18_GC_N, sheet U_CSI_connectors/CSI0_CLK_N
(unnamed): sheet U_Ultrascale_EG/JX1_HP_DP_20_GC_N, sheet U_CSI_connectors/CSI1_CLK_N
(unnamed): sheet U_Ultrascale_EG/JX1_HP_DP_20_GC_P, sheet U_CSI_connectors/CSI1_CLK_P

Not connected (* = marked no-connect by the designer): HDR1 3 4 5 6 7 8; J6 3 5; J7 1* 2* 3*; J13 1* 2* 3*; J14 3 5 7; J16 4 6

## Buses and harness runs
bus loop_back_select[3..0]
bus loop_back_select[3..0] = sheet U_cgra/loop_back_select[3..0]
bus tlx_fwd_flow_tdata[1..0]
bus tlx_fwd_flow_tdata[1..0] = sheet U_cgra/tlx_fwd_flow_tdata[1..0]
bus tlx_fwd_payload_tdata[39..0]
bus tlx_fwd_payload_tdata[39..0] = sheet U_cgra/tlx_fwd_payload_tdata[39..0]
bus tlx_rev_flow_tdata[2..0]
bus tlx_rev_flow_tdata[2..0] = sheet U_cgra/tlx_rev_flow_tdata[2..0]
bus tlx_rev_payload_tdata[79..0]
bus tlx_rev_payload_tdata[79..0] = sheet U_cgra/tlx_rev_payload_tdata[79..0]
bus tpiu_trace_data[3..0]
bus tpiu_trace_data[3..0] = sheet U_cgra/tpiu_trace_data[3..0]

## Notes on the sheet
- Title
- Size:
- Date:
- File:
- D
- Number:
- Time:
- Revision:
- Sheet
- of

## Library data of the parts
DS4-DS6 = CMP-0404-00001-1: LED, SMT, 0603(1608), 1.1mm thickness, Green; Manufacturer: Kingbright; Reverse Voltage: 5 V; Power Dissipation: 75 mW; Forward Current: 30 mA; Packing Type: 2000 pcs / reel; Mounting Technology: Surface Mount; Storage Temperature: -40 to +85 degC; ComponentLink1URL: http://www.kingbright.com/; PackageDescription: 2-Pin SMT LED, 1.6 x 0.8 mm Pitch; PartNumber: KP-1608MGC; PackageReference: 0603LED_GREEN; ComponentLink1Description: Manufacturer URL
J6 J7 J13 J14 J16 J17 = Header 5X2: Header, 5-Pin, Dual row; LatestRevisionDate: 17-Jul-2002; LatestRevisionNote: Re-released for DXP Platform.; Publisher: Altium Limited; Supplier 1: Digi-Key
R38-R40 R43 R56 = RES_10K_0603: RES SMD 10K OHM 1% 1/4W 0603; Manufacturer: Rohm; Manufacturer Part Number: ESR03EZPF1002; Power Rating: 250mW; Temperature Coefficient: 100ppm/°C; Stock 1: 273579; Pricing 1: 1=0.14, 10=0.126, 100=0.0484, 1000=0.0213, 2500=0.01839 (USD); Case/Package: 0603; Case Code (Metric): 1608; Case Code (Imperial): 0603; Min Operating Temperature: -55°C; Max Operating Temperature: 155°C; Tolerance: 1%; Package Quantity: 1; Packaging: Tape and Reel; Composition: Thick Film; Number of Terminations: 2; Max Power Dissipation: 250mW; Features: Automotive AEC-Q200; Length: 0.063inch; Height: 0.022inch; Width: 0.031inch; Lead Free: Lead Free; ComponentLink1URL: https://www.rohm.com/datasheet/ESR01MZPF/esr-e; ComponentLink1Description: https://www.rohm.com/datasheet/ESR01MZPF/esr-e; Supplier 1: Digi-Key
R44 R54 R55 = RES_240_0603: Res Thin Film 0603 240 Ohm 0.1% 0.1W(1/10W) ±25ppm/C Molded SMD Automotive Punched T/R; Manufacturer: Panasonic; Manufacturer Part Number: ERA-3AEB101V; Power Rating: 100mW; Voltage Rating: 75V; Temperature Coefficient: 25ppm/°C; ComponentLink1URL: https://www.rohm.com/datasheet/ESR01MZPF/esr-e; ComponentLink1Description: https://www.rohm.com/datasheet/ESR01MZPF/esr-e; Stock 1: 511300; Pricing 1: 1=0.35, 10=0.3, 100=0.1172, 1000=0.04906, 2500=0.04498 (USD); Mount: Surface Mount; Case/Package: 0603; Number of Pins: 2; Case Code (Metric): 1608; Case Code (Imperial): 0603; Contact Plating: Tin; Min Operating Temperature: -55°C; Max Operating Temperature: 155°C; Tolerance: 0.1%; Packaging: Tape and Reel; Package Quantity: 5000; Composition: Metal Film,Thin Film; Number of Terminations: 2; Termination: SMD/SMT; Military Standard: Not; Max Power Dissipation: 100mW; Length: 1.6mm; Height: 0.45mm; Width: 0.8mm; Depth: 0.8mm; Radiation Hardening: No; REACH SVHC: No SVHC; ComponentLink2URL: http://www.farnell.com/datasheets/485442.pdf; ComponentLink2Description: http://www.farnell.com/datasheets/485442.pdf; ComponentLink3URL: http://industrial.panasonic.com/www-data/pdf/AOA0000/AOA0000CE26.pdf; ComponentLink3Description: http://industrial.panasonic.com/www-data/pdf/AOA0000/AOA0000CE26.pdf; ComponentLink4URL: http://www.farnell.com/datasheets/2059650.pdf; ComponentLink4Description: http://www.farnell.com/datasheets/2059650.pdf; ComponentLink5URL: http://www.farnell.com/datasheets/39837.pdf; ComponentLink5Description: http://www.farnell.com/datasheets/39837.pdf; ComponentLink6URL: http://uk.rs-online.com/webdocs/0fe2/0900766b80fe20f7.pdf; ComponentLink6Description: http://uk.rs-online.com/webdocs/0fe2/0900766b80fe20f7.pdf; ComponentLink7URL: https://www.alliedelec.com/m/d/b6b0537e86f421aa7f5975bb1d8f429a.pdf; ComponentLink7Description: https://www.alliedelec.com/m/d/b6b0537e86f421aa7f5975bb1d8f429a.pdf; ComponentLink8URL: https://www.distrelec.biz/Web/Downloads/_t/ds/ERA_eng_tds.pdf?mime=application%2Fpdf; ComponentLink8Description: https://www.distrelec.biz/Web/Downloads/_t/ds/ERA_eng_tds.pdf?mime=application%2Fpdf; ComponentLink9URL: http://www.produktinfo.conrad.com/datenblaetter/450000-474999/450355-da-01-en-WIDERSTAND_0603_ERA.pdf; ComponentLink9Description: http://www.produktinfo.conrad.com/datenblaetter/450000-474999/450355-da-01-en-WIDERSTAND_0603_ERA.pdf; Supplier 1: Newark
SW1 SW3 SW4 = CMP-1684-00021-1: Tact Switch, SPST-NO, 0.05 A, -35 to 85 degC, 4-Pin THD, RoHS, Bulk; Manufacturer: TE Connectivity; Maximum Contact Resistance: 100mOhm; Mechanical Life: 100000Cycles; Bushing Type: Unthreaded; Switch Configuration: OFF(ON); Maximum DC Voltage Rating: 24V; Contact Rating @ Voltage: 0.05A@24VDC; Actuator Color: Black; Body Orientation: Straight; Function: MomentaryContact; Illumination: N/R; Actuator Style: RoundButton; Actuator Material: PolybutyleneTerephthalate; Dielectric Strength: 500VAC; Pole Throw Configuration: SPST; Actuator Length: 1.4mm; Product Weight: N/A; Contact Material: CopperAlloy; Housing Material: N/A; Terminal Type: PCPins; Minimum Insulation Resistance: 100MOhm; Package Description: 4-Pin Through Hole Device, Body 5.99 x 5.99 mm, Pitch 6.5 mm; Part No: 1825910-6; Package Reference: THD; Base Material: N/A; Manufacturer URL: http://www.te.com; Contact Plating: Silver; RoHS: Yes; Datasheet Version: Rev. C9; Electrical Life: 100000Cycles; Maximum AC Voltage Rating: N/A; Thread Size: N/R; Operating Temperature: -35to85C; Mounting: ThroughHole; Dimension: 5.99x5mm; Datasheet URL: http://www.te.com/commerce/DocumentDelivery/DDEController?Action=showdoc&DocId=Customer+Drawing%7F1825910%7FC9%7Fpdf%7FEnglish%7FENG_CD_1825910_C9.pdf%7F1825910-6; Family: 1825910; Seal Location: N/A; Seal Description: N/A; Packaging: N/A
B5 = 24.243.1: Supplier 1: Newark
HDR1 = 2x8_HDR: Supplier 1: Digi-Key; Supplier Part Number 1: S2011EC-08-ND